# EasyEDA Pro project MSDRv2.eprj, board PCB1
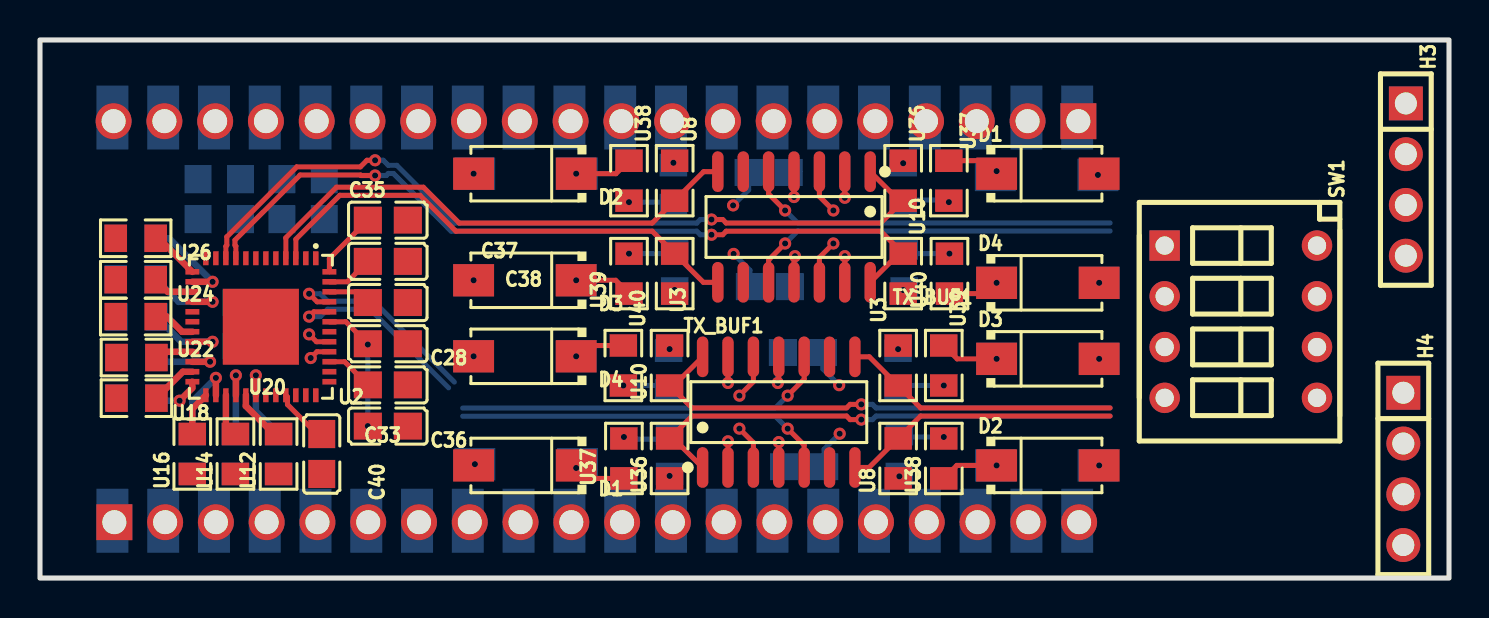
[diagram p7: board, top side]
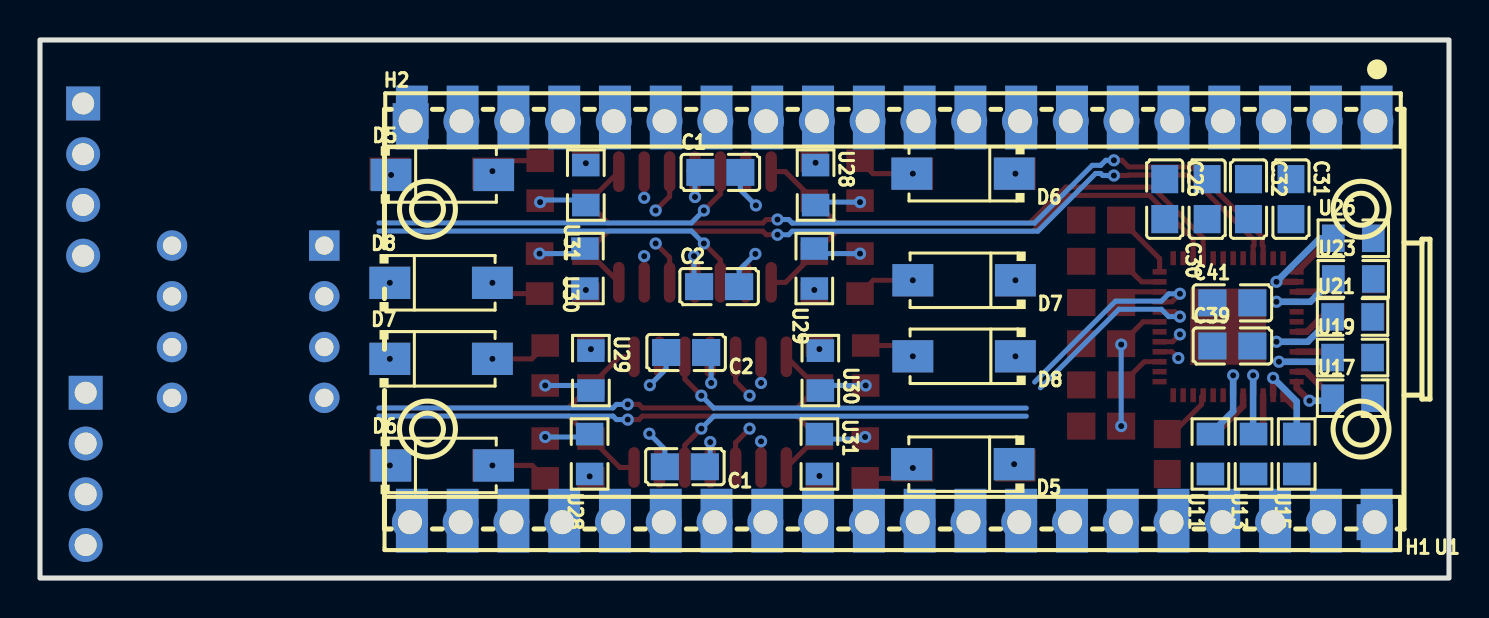
[diagram p8: board, bottom side, seen from below]

Outline 70.48 x 26.92 mm; copper layers: Top Layer, Inner1, Inner2, Bottom Layer. Coordinates in mm from the lower left corner of the outline.
Outline path: rectangle 0,26.92 70.48,0
Stack: Top Layer 0.035mm Outer layer thickness 1oz / Dielectric1 0.2104mm 7628 RC49% 8.6mil / Inner1 0.0152mm Inner layer thickness / Dielectric2 1.065mm 1.1mm H/HOZ Copper / Inner2 0.0152mm Inner layer thickness / Dielectric3 0.2104mm 7628 RC49% 8.6mil / Bottom Layer 0.035mm Outer layer thickness 1oz

## Design rules (mm)
net $1I519\RXIP: $1I519\RXI
net $1I519\RXIN: $1I519\RXI
net $1I519\RXQN: $1I519\RXQ
net $1I519\RXQP: $1I519\RXQ
net $1I519\TXQN: $1I519\TXQ
net $1I519\TXQP: $1I519\TXQ
net $1I519\TXIN: $1I519\TXI
net $1I519\TXIP: $1I519\TXI
template: JLCPCB Capability(Two Layers Board)
spacing copperThickness1oz (default): track to track 0.102, other pairs 0.152 to 0.3
spacing copperThickness2oz: track to track 0.203, other pairs 0.152 to 0.3
track width copperThickness1oz (default): min 0.127, default 0.254, max 2.54
track width copperThickness2oz: min 0.203, default 0.254, max 2.54
differential pair differentialPair (default): width min 0.127, default 0.254, max 2.54; gap min 0.152, default 0.152
via viaSize (default): diameter min 0.5, default 0.61, max 10; hole min 0.3, default 0.305, max 6.3

## Placement (name value [footprint] x y rotation side)
C1  -  [C0805]  36.45 20.3 180 bottom
C1#2  -  [C0805]  38.23 5.57 0 bottom
C2  -  [C0805]  36.51 14.58 180 bottom
C2#2  -  [C0805]  38.16 11.29 0 bottom
C26  330nF  [C0805]  14.22 18.96 270 bottom
C28  100nF  [C0805]  17.4 11.72 180 top
C30  100nF  [C0805]  12.1 18.96 90 bottom
C31  100nF  [C0805]  7.91 18.96 270 bottom
C32  100nF  [C0805]  10.03 18.96 270 bottom
C33  100nF  [C0805]  17.4 9.66 0 top
C35  330nF  [C0805]  17.4 17.91 0 top
C36  100nF  [C0805]  17.4 7.6 180 top
C37  330nF  [C0805]  17.4 15.85 180 top
C38  100nF  [C0805]  17.4 13.79 180 top
C39  100nF  [C0805]  10.84 11.61 180 bottom
C40  100nF  [C0805]  14.1 6.21 90 top
C41  100nF  [C0805]  10.84 13.77 180 bottom
D1  -  [SMA_L4.4-W2.8-LS5.4-RD]  50.42 20.23 0 top
D1#2  -  [SMA_L4.4-W2.8-LS5.4-RD]  24.26 5.63 180 top
D2  -  [SMA_L4.4-W2.8-LS5.4-RD]  24.26 20.23 180 top
D2#2  -  [SMA_L4.4-W2.8-LS5.4-RD]  50.42 5.63 0 top
D3  -  [SMA_L4.4-W2.8-LS5.4-RD]  24.26 14.9 180 top
D3#2  -  [SMA_L4.4-W2.8-LS5.4-RD]  50.42 10.97 0 top
D4  -  [SMA_L4.4-W2.8-LS5.4-RD]  50.42 14.77 0 top
D4#2  -  [SMA_L4.4-W2.8-LS5.4-RD]  24.26 11.09 180 top
D5  -  [SMA_L4.4-W2.8-LS5.4-RD]  50.36 20.17 180 bottom
D5#2  -  [SMA_L4.4-W2.8-LS5.4-RD]  24.32 5.7 0 bottom
D6  -  [SMA_L4.4-W2.8-LS5.4-RD]  24.31 20.23 0 bottom
D6#2  -  [SMA_L4.4-W2.8-LS5.4-RD]  50.36 5.63 180 bottom
D7  -  [SMA_L4.4-W2.8-LS5.4-RD]  24.26 14.9 0 bottom
D7#2  -  [SMA_L4.4-W2.8-LS5.4-RD]  50.42 10.97 180 bottom
D8  -  [SMA_L4.4-W2.8-LS5.4-RD]  50.42 14.77 180 bottom
D8#2  -  [SMA_L4.4-W2.8-LS5.4-RD]  24.26 11.09 0 bottom
H1  -  [HDR-TH_20P-P2.54-V-M-1]  27.85 2.79 0 bottom
H2  -  [HDR-TH_20P-P2.54-V-M-1]  27.81 22.86 180 bottom
H3  -  [HDR-TH_4P-P2.54-V-F]  68.33 19.94 270 top
H4  -  [HDR-TH_4P-P2.54-V-F]  68.2 5.46 270 top
SW1  EDG104S33  [SW-TH_8P-L11.7-W9.7-P2.54-LS7.6-BL]  60.07 12.83 270 top
TX_BUF1  -  [SOIC-14_L8.7-W3.9-P1.27-LS6.0-BL]  37.72 17.57 180 top
TX_BUF1#2  -  [SOIC-14_L8.7-W3.9-P1.27-LS6.0-BL]  36.96 8.3 0 top
U1  PICO  [COMM-SMD_L51.0-W21.0-P2.54_SC0916]  28.07 12.95 0 bottom
U2  MAX5864ETM+  [QFN-48_L7.0-W7.0-P0.50-BL-EP5.1]  11.05 12.57 180 top
U3  -  [R0805]  31.75 15.23 270 top
U3#2  -  [R0805]  42.93 10.63 90 top
U8  -  [R0805]  31.75 19.88 270 top
U8#2  -  [R0805]  42.93 5.98 90 top
U10  -  [R0805]  43.18 15.23 270 top
U10#2  -  [R0805]  31.5 10.63 90 top
U11  100  [R0805]  11.94 6.21 90 bottom
U12  100  [R0805]  11.94 6.21 90 top
U13  100  [R0805]  9.78 6.21 90 bottom
U14  100  [R0805]  9.78 6.21 90 top
U15  100  [R0805]  7.62 6.21 90 bottom
U16  100  [R0805]  7.62 6.21 90 top
U17  100  [R0805]  4.82 9 180 bottom
U18  100  [R0805]  4.82 9 180 top
U19  100  [R0805]  4.82 11.03 180 bottom
U20  100  [R0805]  4.82 11.03 180 top
U21  100  [R0805]  4.82 13.06 180 bottom
U22  100  [R0805]  4.79 13.08 180 top
U23  100  [R0805]  4.79 14.97 180 bottom
U24  100  [R0805]  4.79 14.93 180 top
U25  100  [R0805]  4.79 17 180 bottom
U26  100  [R0805]  4.79 17 180 top
U28  -  [R0805]  31.69 19.66 270 bottom
U28#2  -  [R0805]  42.99 6.21 90 bottom
U29  -  [R0805]  31.75 15.49 90 bottom
U29#2  -  [R0805]  42.93 10.38 270 bottom
U30  -  [R0805]  43.23 15.49 90 bottom
U30#2  -  [R0805]  31.45 10.38 270 bottom
U31  -  [R0805]  43.18 19.66 90 bottom
U31#2  -  [R0805]  31.5 6.21 270 bottom
U36  -  [R0805]  43.18 19.88 270 top
U36#2  -  [R0805]  31.5 5.98 90 top
U37  -  [R0805]  45.47 19.88 270 top
U37#2  -  [R0805]  29.21 5.98 90 top
U38  -  [R0805]  29.46 19.88 270 top
U38#2  -  [R0805]  45.21 5.98 90 top
U39  -  [R0805]  29.46 15.23 90 top
U39#2  -  [R0805]  45.21 10.63 270 top
U40  -  [R0805]  45.49 15.23 90 top
U40#2  -  [R0805]  29.18 10.63 270 top

## Footprints (pads in the part's own frame, mm; a bottom-side part is the same pattern mirrored in y, then rotated)
C0805
  rect 1.41x1.35 smd: 1(-1,0) 2(1,0)
COMM-SMD_L51.0-W21.0-P2.54_SC0916
  rect 1.6x3.2 smd: 1(-24.445,-10.088) 2(-21.905,-10.088) 3(-19.365,-10.088) 4(-16.825,-10.088) 5(-14.285,-10.088) 6(-11.745,-10.088) 7(-9.205,-10.088) 8(-6.665,-10.088) 9(-4.125,-10.088) 10(-1.585,-10.088) 11(0.955,-10.088) 12(3.495,-10.088) 13(6.035,-10.088) 14(8.575,-10.088) 15(11.115,-10.088) 16(13.655,-10.088) 17(16.195,-10.088) 18(18.735,-10.088) 19(21.275,-10.088) 20(23.815,-10.088) 21(23.815,10.088) 22(21.275,10.088) 23(18.735,10.088) 24(16.195,10.088) 25(13.655,10.088) 26(11.115,10.088) 27(8.575,10.088) 28(6.035,10.088) 29(3.495,10.088) 30(0.955,10.088) 31(-1.585,10.088) 32(-4.125,10.088) 33(-6.665,10.088) 34(-9.205,10.088) 35(-11.745,10.088) 36(-14.285,10.088) 37(-16.825,10.088) 38(-19.365,10.088) 39(-21.905,10.088) 40(-24.445,10.088)
HDR-TH_4P-P2.54-V-F
  rect 1.7x1.7 hole 1.1: 1(-3.81,0)
  round 1.7 hole 1.1: 2(-1.27,0) 3(1.27,0) 4(3.81,0)
HDR-TH_20P-P2.54-V-M-1
  rect 1.8x1.8 hole 1.2: 1(-24.13,0)
  round 1.8 hole 1.2: 2(-21.59,0) 3(-19.05,0) 4(-16.51,0) 5(-13.97,0) 6(-11.43,0) 7(-8.89,0) 8(-6.35,0) 9(-3.81,0) 10(-1.27,0) 11(1.27,0) 12(3.81,0) 13(6.35,0) 14(8.89,0) 15(11.43,0) 16(13.97,0) 17(16.51,0) 18(19.05,0) 19(21.59,0) 20(24.13,0)
QFN-48_L7.0-W7.0-P0.50-BL-EP5.1
  rect 0.28x0.7 smd: 1(-2.75,-3.428) 2(-2.25,-3.428) 3(-1.75,-3.428) 4(-1.25,-3.428) 5(-0.75,-3.428) 6(-0.25,-3.428) 7(0.25,-3.428) 8(0.75,-3.428) 9(1.25,-3.428) 10(1.75,-3.428) 11(2.25,-3.428) 12(2.75,-3.428) 25(2.75,3.428) 26(2.25,3.428) 27(1.75,3.428) 28(1.25,3.428) 29(0.75,3.428) 30(0.25,3.428) 31(-0.25,3.428) 32(-0.75,3.428) 33(-1.25,3.428) 34(-1.75,3.428) 35(-2.25,3.428) 36(-2.75,3.428)
  rect 0.7x0.28 smd: 13(3.428,-2.75) 14(3.428,-2.25) 15(3.428,-1.75) 16(3.428,-1.25) 17(3.428,-0.75) 18(3.428,-0.25) 19(3.428,0.25) 20(3.428,0.75) 21(3.428,1.25) 22(3.428,1.75) 23(3.428,2.25) 24(3.428,2.75) 37(-3.428,2.75) 38(-3.428,2.25) 39(-3.428,1.75) 40(-3.428,1.25) 41(-3.428,0.75) 42(-3.428,0.25) 43(-3.428,-0.25) 44(-3.428,-0.75) 45(-3.428,-1.25) 46(-3.428,-1.75) 47(-3.428,-2.25) 48(-3.428,-2.75)
  rect 3.81x3.81 smd: 49(0,0)
R0805
  rect 1.133x1.377 smd: 1(-1,0) 2(1,0)
SMA_L4.4-W2.8-LS5.4-RD
  rect 2.046x1.62 smd: 1(-2.566,0) 2(2.566,0)
SOIC-14_L8.7-W3.9-P1.27-LS6.0-BL
  oval 0.574x2.038 smd: 1(-3.81,-2.769) 2(-2.54,-2.769) 3(-1.27,-2.769) 4(0,-2.769) 5(1.27,-2.769) 6(2.54,-2.769) 7(3.81,-2.769) 8(3.81,2.769) 9(2.54,2.769) 10(1.27,2.769) 11(0,2.769) 12(-1.27,2.769) 13(-2.54,2.769) 14(-3.81,2.769)
SW-TH_8P-L11.7-W9.7-P2.54-LS7.6-BL
  rect 1.524x1.524 hole 0.914: 1(-3.81,-3.81)
  round 1.524 hole 0.914: 2(-1.27,-3.81) 3(1.27,-3.81) 4(3.81,-3.81) 5(3.81,3.81) 6(1.27,3.81) 7(-1.27,3.81) 8(-3.81,3.81)

## Nets
+5V: C1.1 C1#2.1 TX_BUF1.4 TX_BUF1#2.4
-5V: C2.1 C2#2.1 TX_BUF1.11 TX_BUF1#2.11
GND: C1.2 C1#2.2 C2.2 C2#2.2 C26.1 C28.1 C30.2 C31.1 C32.1 C33.2 C35.2 C36.1 C37.1 C38.1 C39.1 C40.1 C41.1 U2.5 U2.7 U2.12 U2.31 U2.32 U2.37 U2.42 U28.2 U28#2.2 U29.2 U29#2.2 U30.2 U30#2.2 U31.1 U31#2.1 U37.2 U37#2.2 U38.2 U38#2.2 U39.2 U39#2.2 U40.2 U40#2.2
VCC: C28.2 C30.1 C31.2 C32.2 C33.1 C36.2 C38.2 C39.2 C40.2 C41.2 U2.2 U2.8 U2.11 U2.18 U2.33 U2.39 U2.43 U2.46
$1I519\$1N1602: C37.2 U2.47
$1I519\$1N1605: U2.30 U11.2
$1I519\$1N1608: U2.29 U12.2
$1I519\$1N1611: U2.28 U13.2
$1I519\$1N1614: U2.27 U14.2
$1I519\$1N1617: U2.26 U15.2
$1I519\$1N1620: U2.25 U16.2
$1I519\$1N1625: U2.24 U17.1
$1I519\$1N1628: U2.23 U18.1
$1I519\$1N1633: U2.21 U20.1
$1I519\$1N1636: U2.20 U21.1
$1I519\$1N1639: U2.19 U22.1
$1I519\$1N1642: U2.16 U23.1
$1I519\$1N1645: U2.15 U24.1
$1I519\$1N1648: U2.14 U25.1
$1I519\$1N1651: U2.13 U26.1
$1I519\$1N1653: C35.1 U2.48
$1I519\$1N1654: C26.2 U2.1
$1I519\$1N1662: U2.22 U19.1
$1I519\BBC_CLK: U2.6
$1I519\BBC_DA0: U26.2
$1I519\BBC_DA1: U25.2
$1I519\BBC_DA2: U24.2
$1I519\BBC_DA3: U23.2
$1I519\BBC_DA4: U22.2
$1I519\BBC_DA5: U21.2
$1I519\BBC_DA6: U20.2
$1I519\BBC_DA7: U19.2
$1I519\BBC_DD0: U18.2
$1I519\BBC_DD1: U17.2
$1I519\BBC_DD2: U16.1
$1I519\BBC_DD3: U15.1
$1I519\BBC_DD4: U14.1
$1I519\BBC_DD5: U13.1
$1I519\BBC_DD6: U12.1
$1I519\BBC_DD7: U11.1
$1I519\CS#: U2.36
$1I519\DIN: U2.34
$1I519\RXIN: TX_BUF1.7 U2.4 U8.2
$1I519\RXIP: TX_BUF1.8 U2.3 U3.1
$1I519\RXQN: TX_BUF1.14 U2.9 U10.1
$1I519\RXQP: TX_BUF1.1 U2.10 U36.2
$1I519\SCLK: U2.35
$1I519\TXIN: U2.44
$1I519\TXIP: U2.45
$1I519\TXQN: U2.40
$1I519\TXQP: U2.41
IN1: TX_BUF1.12 TX_BUF1#2.12
IN2: TX_BUF1.3 TX_BUF1#2.3
IN3: TX_BUF1.5 TX_BUF1#2.5
IN4: TX_BUF1.10 TX_BUF1#2.10
OUT1: TX_BUF1#2.14 U10#2.1
OUT2: TX_BUF1#2.1 U36#2.2
OUT3: TX_BUF1#2.7 U8#2.2
OUT4: TX_BUF1#2.8 U3#2.1
$1N285: H1.20 U1.21
$1N287: H1.19 U1.22
$1N289: H1.18 U1.23
$1N291: H1.17 U1.24
$1N293: H1.16 U1.25
$1N295: H1.15 U1.26
$1N297: H1.14 U1.27
$1N299: H1.13 U1.28
$1N301: H1.12 U1.29
$1N303: H1.11 U1.30
$1N305: H1.10 U1.31
$1N307: H1.9 U1.32
$1N309: H1.8 U1.33
$1N311: H1.7 U1.34
$1N313: H1.6 U1.35
$1N315: H1.5 U1.36
$1N317: H1.4 U1.37
$1N319: H1.3 U1.38
$1N321: H1.2 U1.39
$1N323: H1.1 U1.40
$1N402: H2.20 U1.1
$1N404: H2.19 U1.2
$1N406: H2.18 U1.3
$1N408: H2.17 U1.4
$1N410: H2.16 U1.5
$1N412: H2.15 U1.6
$1N414: H2.14 U1.7
$1N416: H2.13 U1.8
$1N418: H2.12 U1.9
$1N420: H2.11 U1.10
$1N422: H2.10 U1.11
$1N424: H2.9 U1.12
$1N426: H2.8 U1.13
$1N428: H2.7 U1.14
$1N430: H2.6 U1.15
$1N432: H2.5 U1.16
$1N434: H2.4 U1.17
$1N436: H2.3 U1.18
$1N438: H2.2 U1.19
$1N440: H2.1 U1.20
$1N983: D1.1 D1#2.1 D5.2 D5#2.2 U37.1 U37#2.1
$1N984: D1.2 D1#2.2 D5.1 D5#2.1 TX_BUF1.2 TX_BUF1#2.2 U31.2 U31#2.2 U36.1 U36#2.1
$1N985: D2.2 D2#2.2 D6.1 D6#2.1 TX_BUF1.6 TX_BUF1#2.6 U8.1 U8#2.1 U28.1 U28#2.1
$1N986: D2.1 D2#2.1 D6.2 D6#2.2 U38.1 U38#2.1
$1N987: D3.1 D3#2.1 D7.2 D7#2.2 U39.1 U39#2.1
$1N988: D3.2 D3#2.2 D7.1 D7#2.1 TX_BUF1.9 TX_BUF1#2.9 U3.2 U3#2.2 U29.1 U29#2.1
$1N989: D4.2 D4#2.2 D8.1 D8#2.1 TX_BUF1.13 TX_BUF1#2.13 U10.2 U10#2.2 U30.1 U30#2.1
$1N990: D4.1 D4#2.1 D8.2 D8#2.2 U40.1 U40#2.1

Pads without a net: H3 1 2 3 4; H4 1 2 3 4; SW1 1 2 3 4 5 6 7 8; U2 17 38 49

## Via types
v1: diameter 0.61, hole 0.305, Top Layer to Bottom Layer, 72 vias

## Routing (per net, layer and track width the routed paths; a pad name or vN(x,y) marks a point on that pad's centre or on a via; arc(x,y) is an arc through that point)
+5V: length 5.4
  Top Layer w0.254: 36.96,5.53 v1(36.96,6.8) ; TX_BUF1.4 v1(37.72,19.07)
  Bottom Layer w0.254: 36.65,5.51 36.96,5.81 v1(36.96,6.8) ; v1(37.72,19.07) 37.72,20.06 38.02,20.36
-5V: length 5.4
  Top Layer w0.254: TX_BUF1.11 37.72,16.06 v1(37.77,16.11) ; 36.96,11.07 36.96,9.81 v1(36.91,9.76)
  Bottom Layer w0.254: v1(37.77,16.11) 37.77,15.09 38.02,14.84 ; 36.65,11.03 36.91,10.78 v1(36.91,9.76)
GND: length 26.2
  Bottom Layer w0.254: v1(34.67,18.65) 35.45,19.42 C1.2 ; v1(40,7.22) 39.23,6.44 C1#2.2 ; v1(29.46,18.81) 31.58,18.81 31.69,18.92 ; 42.99,6.95 43.1,7.06 v1(45.21,7.06) ; 43.23,16.23 v1(45.49,16.23) ; v1(34.7,16.22) 35.51,15.4 C2.2 ; 31.75,16.23 v1(29.46,16.23) ; C2#2.2 39.16,10.46 v1(39.98,9.65) ; v1(29.21,7.06) 29.32,6.95 31.5,6.95 ; v1(45.47,18.81) 45.36,18.92 43.18,18.92 ; 31.45,9.63 v1(29.18,9.63) ; 42.93,9.63 v1(45.21,9.63)
VCC: length 13.9
  Top Layer w0.254: U2.46 15.86,14.32 C38.2 ; U2.39 15.24,10.82 C33.1 ; C40.2 13.85,7.21 12.38,8.68 12.38,9.06 U2.33 ; v1(16.4,11.68) C28.2 15.3,12.82 U2.43
  Bottom Layer w0.254: v1(16.4,7.6) v1(16.4,11.68)
$1I519\$1N1602: length 2.3
  Top Layer w0.254: U2.47 15.38,14.82 C37.2
$1I519\$1N1605: length 4.4
  Top Layer w0.33: U2.30 v1(10.8,10.14)
  Bottom Layer w0.33: U11.2 10.8,8.34 v1(10.8,10.14)
$1I519\$1N1608: length 2.8
  Top Layer w0.33: U2.29 10.3,8.61 11.7,7.21 U12.2
$1I519\$1N1611: length 3.9
  Top Layer w0.33: U2.28 v1(9.8,10.14)
  Bottom Layer w0.33: v1(9.8,10.14) 9.8,7.23 U13.2
$1I519\$1N1614: length 2.1
  Top Layer w0.33: U14.2 9.3,7.68 U2.27
$1I519\$1N1617: length 4.2
  Top Layer w0.33: U2.26 v1(8.8,10.02)
  Bottom Layer w0.33: v1(8.8,10.02) 7.62,8.84 U15.2
$1I519\$1N1620: length 2.2
  Top Layer w0.33: U16.2 7.62,8.47 U2.25
$1I519\$1N1625: length 2.4
  Top Layer w0.33: U2.24 7.62,9.51 v1(6.98,8.87)
  Bottom Layer w0.33: U17.1 5.95,8.87 v1(6.98,8.87)
$1I519\$1N1628: length 2.3
  Top Layer w0.33: U2.23 7.15,10.32 U18.1
$1I519\$1N1633: length 1.9
  Top Layer w0.33: U2.21 6.12,11.32 U20.1
$1I519\$1N1636: length 4.3
  Top Layer w0.33: U2.20 v1(8.63,11.82)
  Bottom Layer w0.33: v1(8.63,11.82) 7.07,11.82 U21.1
$1I519\$1N1639: length 2.1
  Top Layer w0.33: U22.1 6.35,13.08 7.11,12.32 U2.19
$1I519\$1N1642: length 4.3
  Top Layer w0.33: U2.16 v1(8.63,13.82)
  Bottom Layer w0.33: v1(8.63,13.82) 6.94,13.82 U23.1
$1I519\$1N1645: length 2.1
  Top Layer w0.33: U2.15 6.39,14.32 U24.1
$1I519\$1N1648: length 4.8
  Top Layer w0.33: U2.14 v1(8.63,14.82)
  Bottom Layer w0.33: U25.1 6.46,17 v1(8.63,14.82)
$1I519\$1N1651: length 2.5
  Top Layer w0.33: U2.13 5.94,17 U26.1
$1I519\$1N1653: length 3.4
  Top Layer w0.254: C35.1 14.48,15.98 U2.48
$1I519\$1N1662: length 3.7
  Top Layer w0.33: U2.22 v1(8.51,10.82)
  Bottom Layer w0.33: U19.1 6.03,10.82 v1(8.51,10.82)
$1I519\RXIN: length 25.5
  Top Layer w0.254: U2.4 12.3,17.03 14.83,19.56 19.18,19.56 20.97,17.76 30.63,17.76 U8.2 33.2,20.34 TX_BUF1.7
$1I519\RXIP: length 24.8
  Top Layer w0.254: U2.3 12.8,16.95 15,19.15 19.01,19.15 20.8,17.36 30.63,17.36 U3.1 33.19,14.8 TX_BUF1.8
$1I519\RXQN: length 39.8
  Top Layer w0.254: v1(33.59,17.18) 34.15,17.18 34.33,17.36 42.06,17.36 U10.1 42.96,16.23 TX_BUF1.14 ; U2.9 9.8,16.6 9.75,16.65 9.75,16.91 13.01,20.17 16.03,20.17 16.05,20.14 v1(16.76,20.14)
  Bottom Layer w0.254: v1(16.76,20.14) 17.32,20.14 17.42,20.24 17.68,20.24 20.57,17.36 32.85,17.36 33.03,17.18 v1(33.59,17.18)
$1I519\RXQP: length 40.7
  Top Layer w0.254: v1(33.59,17.94) 34.15,17.94 34.33,17.76 42.06,17.76 U36.2 42.98,18.88 TX_BUF1.1 ; U2.10 9.3,16.6 9.35,16.65 9.35,17.07 12.85,20.57 16.03,20.57 16.36,20.9 v1(16.76,20.9)
  Bottom Layer w0.254: v1(16.76,20.9) 17.17,20.9 17.42,20.65 17.85,20.65 20.73,17.76 32.85,17.76 33.03,17.94 v1(33.59,17.94)
$1I519\TXIN: length 9.9
  Top Layer w0.254: v1(13.46,13.08) 13.7,13.32 U2.44
  Bottom Layer w0.254: 20.44,9.52 16.51,13.45 14.39,13.45 14.02,13.08 v1(13.46,13.08)
$1I519\TXIP: length 10.3
  Top Layer w0.254: U2.45 13.86,13.82 v1(13.46,14.22)
  Bottom Layer w0.254: v1(13.46,14.22) 14.02,14.22 14.39,13.86 16.68,13.86 20.73,9.81
$1I519\TXQN: length 9
  Top Layer w0.254: v1(13.54,11.01) 13.86,11.32 U2.40
  Inner1 w0.254: 19.94,8.1 18.04,8.1 14.74,11.4 14.49,11.4 14.1,11.01 v1(13.54,11.01)
$1I519\TXQP: length 9.2
  Top Layer w0.254: U2.41 13.83,11.82 v1(13.46,12.19)
  Inner1 w0.254: 19.94,8.51 18.21,8.51 14.91,11.8 14.41,11.8 14.02,12.19 v1(13.46,12.19)
IN1: length 32.7
  Top Layer w0.254: 35.69,11.07 35.69,9.83 v1(34.99,9.13) ; v1(39.69,16.74) 38.99,16.04 TX_BUF1.12
  Inner1 w0.254: 21.15,8.5 34.37,8.5 v1(34.99,9.13) ; v1(39.69,16.74) 40.31,17.36 53.53,17.36
IN2: length 32.7
  Top Layer w0.254: TX_BUF1.3 38.99,19.09 v1(39.69,18.39) ; 35.69,5.53 35.69,6.78 v1(34.99,7.48)
  Inner1 w0.254: 21.15,8.1 34.37,8.1 v1(34.99,7.48) ; v1(39.69,18.39) 40.31,17.77 53.53,17.77
IN3: length 37.6
  Top Layer w0.254: v1(37.4,7.48) 38.23,6.65 38.23,5.53 ; v1(37.27,18.39) 36.45,19.22 TX_BUF1.5
  Bottom Layer w0.254: v1(37.4,7.48) 36.78,8.1 21.15,8.1 ; 53.53,17.77 37.9,17.77 v1(37.27,18.39)
IN4: length 37.6
  Top Layer w0.254: TX_BUF1.10 36.45,15.92 v1(37.27,16.74) ; v1(37.4,9.13) 38.23,9.95 38.23,11.07
  Bottom Layer w0.254: 21.15,8.5 36.78,8.5 v1(37.4,9.13) ; 53.53,17.36 37.9,17.36 v1(37.27,16.74)
OUT1: length 24.9
  Top Layer w0.254: v1(41.08,8.69) 40.53,8.69 40.35,8.51 32.62,8.51 U10#2.1 31.71,9.63 33.15,11.07
  Bottom Layer w0.254: v1(41.08,8.69) 41.64,8.69 41.82,8.51 53.53,8.51
OUT2: length 24.9
  Top Layer w0.254: v1(41.08,7.93) 40.53,7.93 40.35,8.11 32.62,8.11 U36#2.2 31.7,6.98 33.15,5.53
  Bottom Layer w0.254: v1(41.08,7.93) 41.64,7.93 41.82,8.11 53.53,8.11
OUT3: length 13.8
  Top Layer w0.254: 40.77,5.53 41.48,5.53 U8#2.2 44.05,8.11 53.53,8.11
OUT4: length 13.8
  Top Layer w0.254: 40.77,11.07 41.49,11.07 U3#2.1 44.05,8.51 53.53,8.51
$1N983: length 5.2
  Top Layer w0.254: v1(47.85,20.36) 47.33,20.88 U37.1 ; U37#2.1 27.35,4.98 v1(26.82,5.51)
$1N984: length 31.9
  Top Layer w0.254: v1(34.42,6.84) 34.42,5.53 ; v1(40.26,19.03) 40.26,20.33
  Inner1 w0.254: v1(34.42,6.84) 33.78,6.21 30.48,6.21 ; v1(31.5,5.11) 31.5,5.19 30.48,6.21 ; 30.48,6.21 27.2,6.21 27.19,6.22 26.71,6.22 26.7,6.21 22.39,6.21 22.01,5.82 21.88,5.82 v1(21.76,5.7) ; v1(40.26,19.03) 40.9,19.66 44.2,19.66 ; v1(43.18,20.76) 43.18,20.68 44.2,19.66 ; 44.2,19.66 47.47,19.66 47.48,19.65 47.97,19.65 47.98,19.66 52.29,19.66 52.67,20.04 52.79,20.04 v1(52.92,20.17)
$1N985: length 21.5
  Inner1 w0.254: v1(21.69,20.23) 22.28,19.65 27.06,19.65 27.08,19.66 30.61,19.66 31.69,20.74 v1(31.69,20.78) ; v1(42.99,5.09) 42.99,5.13 44.07,6.21 47.6,6.21 47.61,6.22 52.4,6.22 v1(52.98,5.63)
$1N986: length 5.8
  Top Layer w0.254: U38#2.1 45.86,5.63 v1(47.85,5.63) ; v1(26.82,20.23) 28.81,20.23 U38.1
$1N987: length 5.8
  Top Layer w0.254: U39.1 28.8,14.9 v1(26.82,14.9) ; v1(47.85,10.97) 45.88,10.97 U39#2.1
$1N988: length 21.5
  Inner1 w0.254: v1(31.75,14.41) 30.69,15.47 27.08,15.47 27.06,15.48 22.28,15.48 v1(21.69,14.9) ; v1(52.98,10.97) 52.4,10.38 47.61,10.38 47.6,10.4 43.98,10.4 v1(42.93,11.45)
$1N989: length 31.8
  Top Layer w0.254: v1(34.42,9.76) 34.42,11.07 ; v1(40.26,16.11) 40.26,14.8
  Inner1 w0.254: v1(31.5,11.46) 30.56,10.52 ; 30.56,10.52 33.65,10.52 v1(34.42,9.76) ; 30.56,10.52 27.08,10.52 27.06,10.51 22.28,10.51 v1(21.69,11.09) ; 44.11,15.34 41.02,15.34 v1(40.26,16.11) ; 44.11,15.34 v1(43.18,14.41) ; 44.11,15.34 47.6,15.34 47.61,15.36 52.4,15.36 v1(52.98,14.77)
$1N990: length 5.2
  Top Layer w0.254: U40#2.1 27.36,11.63 v1(26.82,11.09) ; v1(47.85,14.77) 47.31,14.23 U40.1
